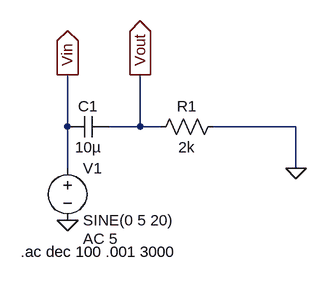
[diagram p0: schematic Draft1.asc]
Draft1.asc, the LTspice schematic file:
Version 4
SHEET 1 880 680
WIRE 32 160 32 80
WIRE 144 160 144 80
WIRE 144 160 96 160
WIRE 176 160 144 160
WIRE 384 160 256 160
WIRE 32 224 32 160
WIRE 384 224 384 160
FLAG 32 80 Vin
IOPIN 32 80 Out
FLAG 144 80 Vout
IOPIN 144 80 Out
FLAG 384 224 0
FLAG 32 304 0
SYMBOL cap 96 144 R90
WINDOW 0 0 32 VBottom 2
WINDOW 3 32 32 VTop 2
SYMATTR InstName C1
SYMATTR Value 10µ
SYMBOL res 272 144 R90
WINDOW 0 0 56 VBottom 2
WINDOW 3 32 56 VTop 2
SYMATTR InstName R1
SYMATTR Value 2k
SYMBOL voltage 32 208 R0
WINDOW 123 24 124 Left 2
WINDOW 39 0 0 Left 0
SYMATTR InstName V1
SYMATTR Value SINE(0 5 20)
SYMATTR Value2 AC 5
TEXT -40 352 Left 2 !.ac dec 100 .001 3000

The netlist it stands for:
* Draft1.asc
C1 Vout Vin 10µ
R1 0 Vout 2k
V1 Vin 0 SINE(0 5 20) AC 5
.ac dec 100 .001 3000
.backanno
.end